# EAGLE schematic LOGIC_LEVEL_CONVERTER (EAGLE 9.6.2)
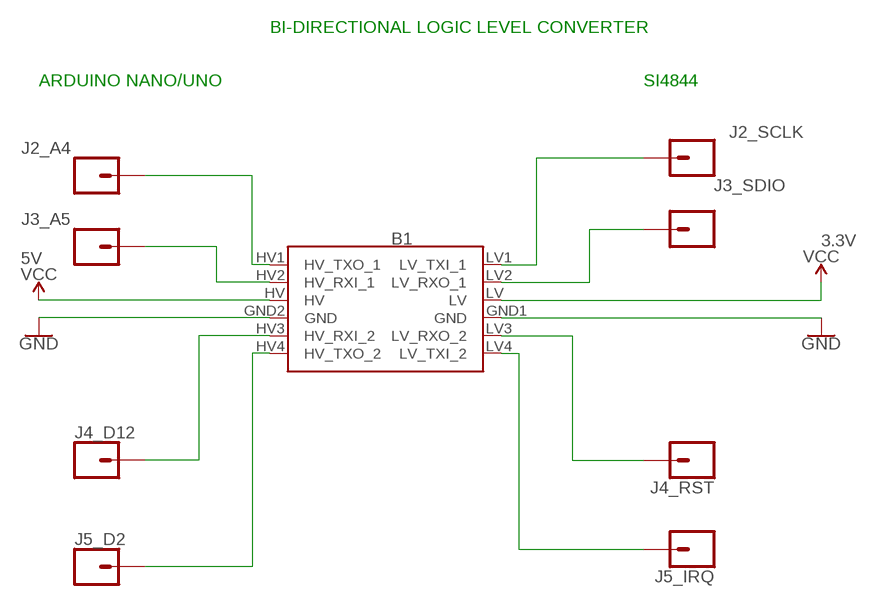
[diagram p0: schematic, sheet 1]

## Parts
B1  SPARKFUN_LOGIC_LEVEL_CONVERTERLOCK  [SPARKFUN_LOGIC_LEVEL_CONVERTER_LOCK]
J2_A4  CONN_01  [1X01]
J2_SCLK  CONN_01  [1X01]
J3_A5  CONN_01  [1X01]
J3_SDIO  CONN_01  [1X01]
J4_D12  CONN_01  [1X01]
J4_RST  CONN_01  [1X01]
J5_D2  CONN_01  [1X01]
J5_IRQ  CONN_01  [1X01]

## Nets
GND: B1.GND1(GND) B1.GND2(GND)
N$1: B1.HV1(HV_TXO_1) J2_A4.1
N$2: B1.HV2(HV_RXI_1) J3_A5.1
N$3: B1.LV1(LV_TXI_1) J2_SCLK.1
N$4: B1.LV2(LV_RXO_1) J3_SDIO.1
N$5: B1.HV4(HV_TXO_2) J5_D2.1
N$6: B1.HV3(HV_RXI_2) J4_D12.1
N$7: B1.LV4(LV_TXI_2) J5_IRQ.1
N$8: B1.LV3(LV_RXO_2) J4_RST.1
VCC: B1.HV B1.LV

## Notes on the sheet
- BI-DIRECTIONAL LOGIC LEVEL CONVERTER
- ARDUINO NANO/UNO | SI4844

## Library data of the parts
B1 = SparkFun-Boards:SPARKFUN_LOGIC_LEVEL_CONVERTER: SparkFun Logic Level Converter -Bi-Directional This is the mechnical outline for the 3.3V - 5V bi directional logic level converter. *Note, the "LOCK" Package has the header pins staggered by an offset of 5 mils (off center line), so that when you slide a row of standard 0.1" headers into the PTH pads, it will hold position vertically. See the follwing turorial for more information on this type of special footprints: Sneaky Footprints <https://www.sparkfun.com/tutorials/114> SparkFun Products: SparkFun Logic Level Converter - Bi-Directional <https://www.sparkfun.com/products/12009>
J2_A4 J2_SCLK J3_A5 J3_SDIO J4_D12 J4_RST J5_D2 J5_IRQ = SparkFun-Connectors:CONN_01: Single connection point. Often used as Generic Header-pin footprint for 0.1 inch spaced/style header connections On any of the 0.1 inch spaced packages, you can populate with these: Break Away Headers - Straight <https://www.sparkfun.com/products/116> (PRT-00116) Break Away Male Headers - Right Angle <https://www.sparkfun.com/products/553> (PRT-00553) Female Headers <https://www.sparkfun.com/products/115> (PRT-00115) Break Away Headers - Machine Pin <https://www.sparkfun.com/products/117> (PRT-00117) Break Away Female Headers - Swiss Machine Pin <https://www.sparkfun.com/products/743> (PRT-00743) This device is also useful as a general connection point to wire up your design to another part of your project. Our various solder wires solder well into these plated through hole pads. Hook-Up Wire - Assortment (Stranded, 22 AWG) <https://www.sparkfun.com/products/11375> (PRT-11375) Hook-Up Wire - Assortment (Solid Core, 22 AWG) <https://www.sparkfun.com/products/11367> (PRT-11367) View the entire wire category on our website here <https://www.sparkfun.com/categories/141> Special notes: SMTSO-256-ET is a "flush mount" nut for a 4-40 screw. We mostly use this on specialty testbeds; it is a nice way to connect hardware to your PCB at an adjustable hieght. Also note, the SNAP packages are for using a snappable style connector. We sell a baggie of snaps and they are also used on two LilyPad designs: Snap Assortment - 30 pack (male and female) <https://www.sparkfun.com/products/11347> (DEV-11347) LilyPad Arduino SimpleSnap <https://www.sparkfun.com/products/10941> (DEV-10941) LilyPad SimpleSnap Protoboard <https://www.sparkfun.com/products/10940> (DEV-10940)